# EAGLE design 38kHzSensorRevA2 (EAGLE 7.2.0)
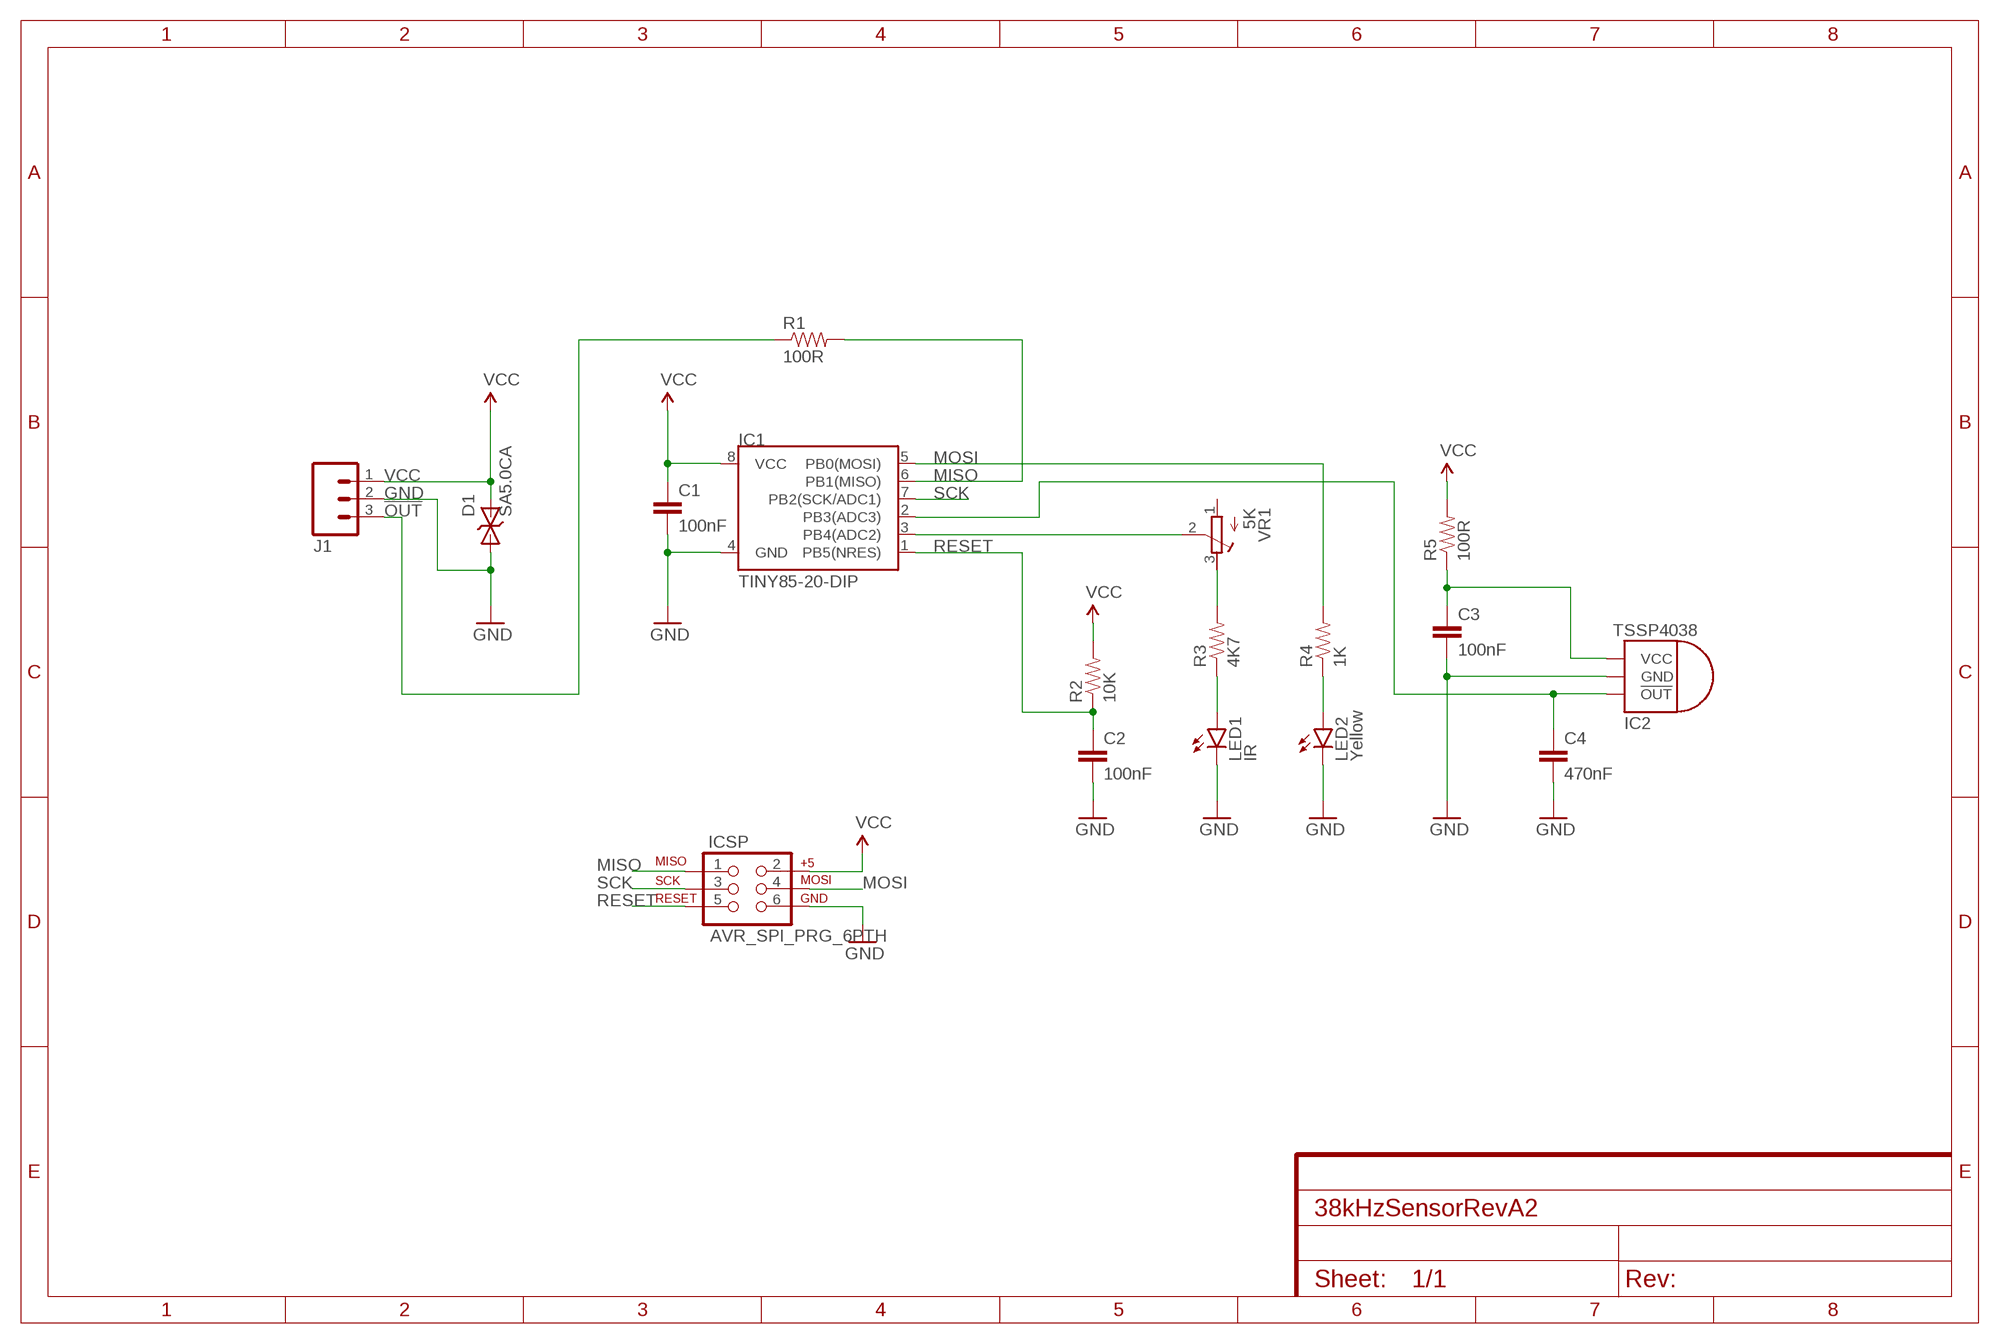
[diagram p0: schematic, sheet 1]
FRAME1 (FRAME-A4L): CNAME: 38kHz IR Simulator Sensor (Variant 2); CREVISION: A/2; DESIGNER: Andrew Instone-Cowie

## Parts
C1  100nF  CAPPTH  [CAP-PTH-SMALL]
C2  100nF  CAPPTH  [CAP-PTH-SMALL]
C3  100nF  CAPPTH  [CAP-PTH-SMALL]
C4  470nF  CAPPTH1  [CAP-PTH-5MM]
D1  SA5.0CA  [DO41_TVS]
IC1  TINY85-20-DIP  ATTINY45TINY85-20-DIP  [DIP08]
IC2  TSSP4038EDGE  [TSSP4038_PKG_EDGE]
ICSP  AVR_SPI_PRG_6PTH  [2X3]
J1  M03PTH  [1X03]
LED1  IR  LED5MM  [LED5MM]
LED2  Yellow  LED3MM  [LED3MM]
R1  100R  RESISTORPTH-1/4W  [AXIAL-0.4]
R2  10K  RESISTORPTH-1/4W  [AXIAL-0.4]
R3  4K7  RESISTORPTH-1/4W  [AXIAL-0.4]
R4  1K  RESISTORPTH-1/4W  [AXIAL-0.4]
R5  100R  RESISTORPTH-1/4W  [AXIAL-0.4]
VR1  5K  R-TRIMM3296X  [RTRIM3296X]

## Nets
!OUT: J1.3 R1.P$1
GND: C1.2 C2.2 C3.2 C4.2 D1.A IC1.4(GND) IC2.GND ICSP.6 J1.2 LED1.K(C) LED2.K(C)
MISO: IC1.6(PB1(MISO)) ICSP.1 R1.P$2
MOSI: IC1.5(PB0(MOSI)) ICSP.4 R4.P$2
N$1: IC1.3(PB4(ADC2)) VR1.2(S)
N$2: R3.P$2 VR1.3(E)
N$3: C4.1 IC1.2(PB3(ADC3)) IC2.OUT(!OUT)
N$4: C3.1 IC2.VCC R5.P$1
N$5: LED1.A R3.P$1
N$6: LED2.A R4.P$1
RESET: C2.1 IC1.1(PB5(NRES)) ICSP.5 R2.P$1
SCK: IC1.7(PB2(SCK/ADC1)) ICSP.3
VCC: C1.1 D1.C IC1.8(VCC) ICSP.2 J1.1 R2.P$2 R5.P$2
Unconnected: VR1.1(A)

## Library data of the parts
C1-C4 = SparkFun-Passives:CAP: Capacitor Standard 0603 ceramic capacitor, and 0.1" leaded capacitor.
D1 = AIC_Custom:SA5.0CA: SA5.0CA TVS Bi-Directional Transient Voltage Suppressor. 5V, DO41 package
IC1 = SparkFun-DigitalIC:ATTINY45: Atmel 8-pin 2/4/8kB flash uC; PROD_ID: IC-09445
IC2 = AIC_Custom:TSSP4038: TSSP4038 38kHz IR Receiver
ICSP = SparkFun-Connectors:AVR_SPI_PRG_6: AVR ISP 6 Pin This is the reduced ISP connector for AVR programming. Common on Arduino. This footprint will take up less PCB space and can be used with a 10-pin to 6-pin adapter such as SKU: BOB-08508 **Special note about "TEST_POINT" package. The stop mask is on the top side, so if you want your programming test points to be on the bottom of your board, make sure to place this package on the bottom side of the board. This also ensure that the orientation to program from the bottom side will be correct.
J1 = SparkFun-Connectors:M03: Header 3 Standard 3-pin 0.1" header. Use with straight break away headers (SKU : PRT-00116), right angle break away headers (PRT-00553), swiss pins (PRT-00743), machine pins (PRT-00117), and female headers (PRT-00115). Molex polarized connector foot print use with SKU : PRT-08232 with associated crimp pins and housings.
LED1 LED2 = SparkFun-LED:LED: LEDs Standard schematic elements and footprints for 5mm, 3mm, 1206, and 0603 sized LEDs. 5mm - Spark Fun Electronics SKU : COM-00529 (and others)
R1-R5 = SparkFun-Passives:RESISTOR: Resistor Basic schematic elements and footprints for 0603, 1206, and PTH resistors.
VR1 = resistor:R-TRIMM: Trimm resistor

## Board
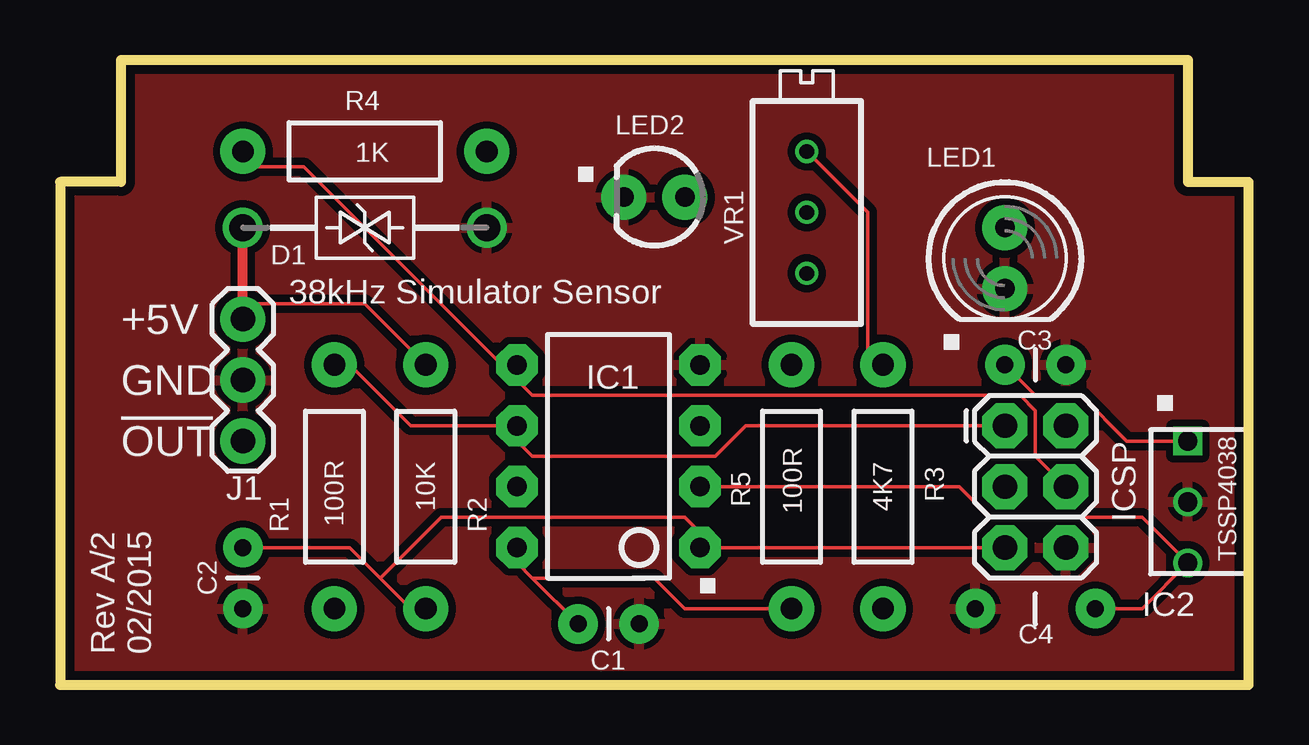
[diagram p1: board, top side]
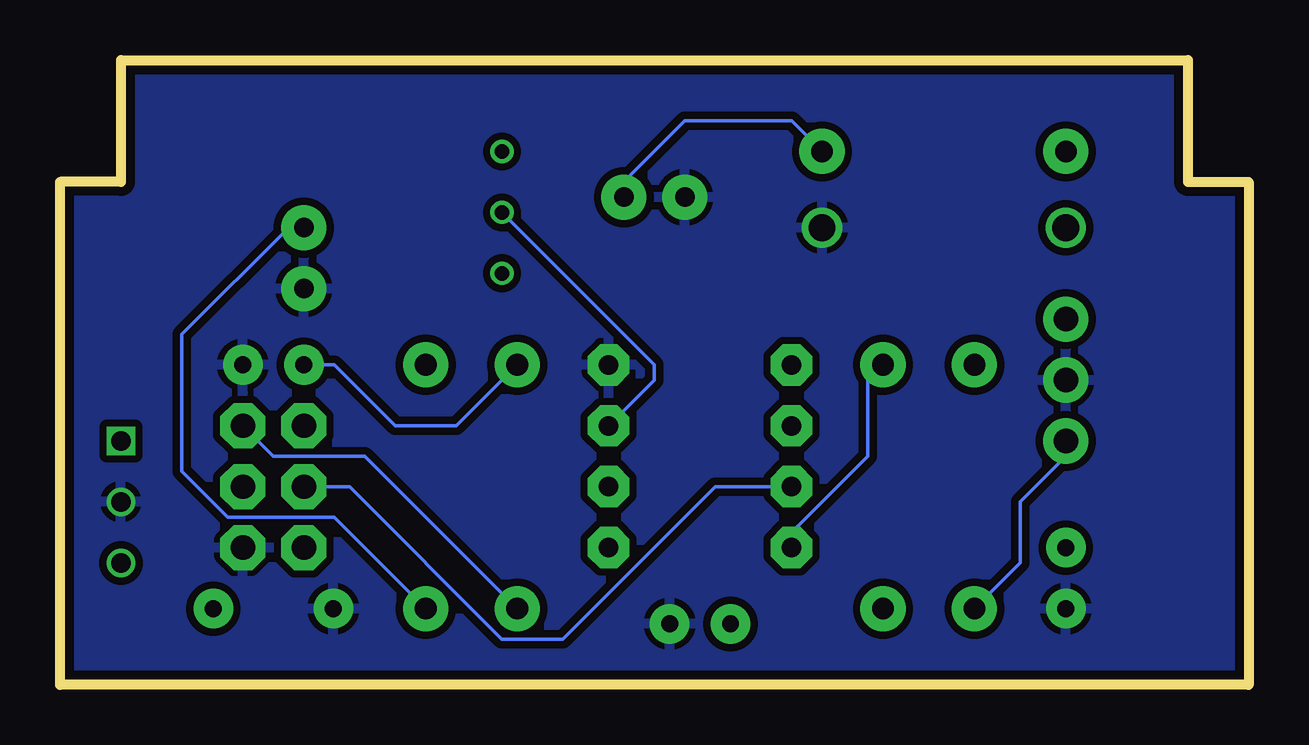
[diagram p2: board, bottom side, seen from below]

Size 49.53 x 26.04 mm. Coordinates in mm from the lower left corner, seen from the top.
Outline: 0,0 49.53,0 49.53,20.95 46.99,20.95 46.99,26.04 2.54,26.04 2.54,20.95 0,20.95 0,0
Copper layers (1*16): Top 0.0356mm / dielectric 1.5011mm / Bottom 0.0356mm
Design rules "LaenPCBOrder(OSHPARK)": minimum track width 6mil, minimum drill 13mil, track to track 6mil, track to pad 6mil, pad to pad 6mil, via to via 6mil, smd to smd 6mil, copper to edge 15mil, drill to drill 6mil, minimum pad ring 7mil, minimum via ring 7mil, stop-mask expansion 3mil, vias tented up to drill 0mil, thermal gap 10mil

### Footprints (pad centres in the part's own frame; a part is rotated, then mirrored left to right if it is on the bottom)
CAP-PTH-SMALL = drill 0.7 pad 1.651: 1 0,0; 2 2.54,0
CAP-PTH-5MM = drill 0.7 pad 1.651: 1 -2.5,0; 2 2.5,0
DO41_TVS = drill 1.118: A 5.08,0; C -5.08,0
DIP08 = drill 0.813 pad 1.727 octagon: 1 -3.81,-3.81; 2 -1.27,-3.81; 3 1.27,-3.81; 4 3.81,-3.81; 5 3.81,3.81; 6 1.27,3.81; 7 -1.27,3.81; 8 -3.81,3.81
TSSP4038_PKG_EDGE = drill 0.8: GND 0,0; OUT 2.54,0 | drill 0.8 square: VCC -2.54,0
2X3 = drill 1.016 pad 1.88 octagon: 1 0,0; 2 0,2.54; 3 2.54,0; 4 2.54,2.54; 5 5.08,0; 6 5.08,2.54
1X03 = drill 1.016 pad 1.88: 1 0,0; 2 2.54,0; 3 5.08,0
LED5MM = drill 0.813 pad 1.88: A -1.27,0; K 1.27,0
LED3MM = drill 0.813 pad 1.88: A -1.27,0; K 1.27,0
AXIAL-0.4 = drill 0.9 pad 1.88: P$1 -5.08,0; P$2 5.08,0
RTRIM3296X = drill 0.61: 1 0,-2.54; 2 0,0; 3 0,2.54

### Placement (x,y rotation side)
C1  21.59,2.54 0 top
C2  7.62,5.71 270 top
C3  39.37,13.34 0 top
C4  40.64,3.17 180 top
D1  12.7,19.05 0 top
IC1  22.86,9.53 90 top
IC2  46.99,7.62 270 top
ICSP  39.37,10.79 270 top
J1  7.62,15.24 270 top
LED1  39.37,17.78 270 top
LED2  24.77,20.32 180 top
R1  11.43,8.26 90 top
R2  15.24,8.26 90 top
R3  34.29,8.26 90 top
R4  12.7,22.23 180 top
R5  30.48,8.26 270 top
VR1  31.11,19.68 0 top

### Tracks (layer width: path | path; a pad name or v marks a point on that pad's centre or on a via)
!OUT
  Bottom 0.152: R1.P$1 9.53,5.08 9.53,7.62 7.62,9.53 J1.3
GND
  pour Bottom (isolate 0.305): 2.54,26.04 2.54,20.95 0,20.95 0,0 49.53,0 49.53,20.95 46.99,20.95 46.99,26.04
  pour Top (isolate 0.305): 2.54,26.04 2.54,20.95 0,20.95 0,0 49.53,0 49.53,20.95 46.99,20.95 46.99,26.04
MISO
  Top 0.152: 18.41,10.79 14.61,10.79 12.06,13.34 R1.P$2 | ICSP.1 28.57,10.79 27.3,9.53 19.68,9.53 18.41,10.79 | 18.41,10.79 IC1.6
MOSI
  Top 0.152: 18.41,13.34 10.16,21.59 8.26,21.59 R4.P$2 | ICSP.4 40.64,9.53 40.64,11.43 40.01,12.06 19.68,12.06 18.41,13.34 | 18.41,13.34 IC1.5
N$1
  Bottom 0.152: VR1.2 24.77,13.34 24.77,12.7 IC1.3
N$2
  Top 0.152: VR1.3 33.66,19.68 33.66,13.97 R3.P$2
N$3
  Top 0.152: C4.1 45.09,3.17 IC2.OUT 45.09,6.99 38.73,6.99 37.47,8.26 IC1.2
N$4
  Top 0.152: IC2.VCC 44.45,10.16 42.55,12.06 40.64,12.06 C3.1
  Bottom 0.152: R5.P$1 33.02,10.79 35.56,10.79 38.1,13.34 C3.1
N$5
  Bottom 0.152: R3.P$1 38.1,6.99 42.55,6.99 44.45,8.89 44.45,14.61 40.01,19.05 LED1.A
N$6
  Bottom 0.152: R4.P$1 19.05,23.5 23.5,23.5 26.04,20.95 LED2.A
RESET
  Top 0.152: C2.1 12.06,5.71 13.34,4.45 | 13.34,4.45 14.61,3.17 R2.P$1 | ICSP.5 27.3,5.71 | 13.34,4.45 15.88,6.99 26.04,6.99 27.3,5.71 | 27.3,5.71 IC1.1
SCK
  Bottom 0.152: IC1.7 22.23,8.26 28.57,1.91 31.11,1.91 37.47,8.26 ICSP.3
VCC
  Top 0.152: 19.68,4.45 19.05,5.08 IC1.8 | 19.68,4.45 C1.1 | R2.P$2 12.7,15.88 7.62,15.88 J1.1 | R5.P$2 26.04,3.17 24.77,4.45 19.68,4.45
  Top 0.406: 7.62,15.88 D1.C
  Bottom 0.152: R5.P$2 36.83,9.53 40.64,9.53 ICSP.2 | IC1.8 19.05,6.35 15.88,9.53 15.88,12.7 R2.P$2

### Text on the board
tPlace: 38kHz Simulator Sensor | +5V / GND / !OUT | Rev A/2 / 02/2015